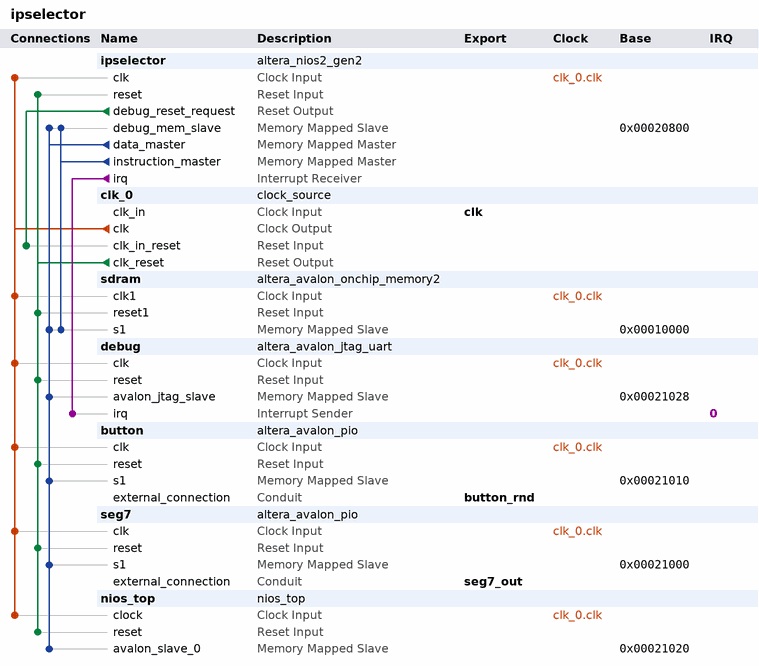
[diagram p0: system contents]
# Platform Designer (Qsys) system ipselector, MAX 10 10M50DAF484C7G
# Parameters at their usual value, and those the tool derives, are not listed.
package require -exact qsys 22.1
create_system ipselector
set_project_property DEVICE_FAMILY {MAX 10}
set_project_property DEVICE 10M50DAF484C7G

add_instance ipselector altera_nios2_gen2 22.1
set_instance_parameter_value ipselector dcache_size 2048
set_instance_parameter_value ipselector exceptionSlave sdram.s1
set_instance_parameter_value ipselector icache_size 4096
set_instance_parameter_value ipselector impl Tiny
set_instance_parameter_value ipselector resetSlave sdram.s1

add_instance clk_0 clock_source 22.1
set_instance_parameter_value clk_0 clockFrequency 50000000

add_instance sdram altera_avalon_onchip_memory2 22.1
set_instance_parameter_value sdram dataWidth 16
set_instance_parameter_value sdram dualPort false
set_instance_parameter_value sdram initMemContent true
set_instance_parameter_value sdram initializationFileName onchip_mem.hex
set_instance_parameter_value sdram memorySize 40960

add_instance debug altera_avalon_jtag_uart 22.1
set_instance_parameter_value debug simInteractiveOptions NO_INTERACTIVE_WINDOWS

add_instance button altera_avalon_pio 22.1
set_instance_parameter_value button direction Input
set_instance_parameter_value button width 1

add_instance seg7 altera_avalon_pio 22.1
set_instance_parameter_value seg7 direction Output
set_instance_parameter_value seg7 width 8

add_instance nios_top nios_top 1.0

# connections
add_connection clk_0.clk button.clk clock
add_connection clk_0.clk debug.clk clock
add_connection clk_0.clk ipselector.clk clock
add_connection clk_0.clk nios_top.clock clock
add_connection clk_0.clk sdram.clk1 clock
add_connection clk_0.clk seg7.clk clock
add_connection clk_0.clk_reset button.reset reset
add_connection clk_0.clk_reset debug.reset reset
add_connection clk_0.clk_reset ipselector.reset reset
add_connection clk_0.clk_reset nios_top.reset reset
add_connection clk_0.clk_reset sdram.reset1 reset
add_connection clk_0.clk_reset seg7.reset reset
add_connection ipselector.debug_reset_request clk_0.clk_in_reset reset
add_connection ipselector.data_master button.s1 avalon
set_connection_parameter_value ipselector.data_master/button.s1 baseAddress 0x00021010
add_connection ipselector.data_master debug.avalon_jtag_slave avalon
set_connection_parameter_value ipselector.data_master/debug.avalon_jtag_slave baseAddress 0x00021028
add_connection ipselector.data_master ipselector.debug_mem_slave avalon
set_connection_parameter_value ipselector.data_master/ipselector.debug_mem_slave baseAddress 0x00020800
add_connection ipselector.data_master nios_top.avalon_slave_0 avalon
set_connection_parameter_value ipselector.data_master/nios_top.avalon_slave_0 baseAddress 0x00021020
add_connection ipselector.data_master sdram.s1 avalon
set_connection_parameter_value ipselector.data_master/sdram.s1 baseAddress 0x00010000
add_connection ipselector.data_master seg7.s1 avalon
set_connection_parameter_value ipselector.data_master/seg7.s1 baseAddress 0x00021000
add_connection ipselector.instruction_master ipselector.debug_mem_slave avalon
set_connection_parameter_value ipselector.instruction_master/ipselector.debug_mem_slave baseAddress 0x00020800
add_connection ipselector.instruction_master sdram.s1 avalon
set_connection_parameter_value ipselector.instruction_master/sdram.s1 baseAddress 0x00010000
add_connection ipselector.irq debug.irq interrupt
set_connection_parameter_value ipselector.irq/debug.irq irqNumber 0

# exported interfaces
add_interface button_rnd conduit end
set_interface_property button_rnd EXPORT_OF button.external_connection
add_interface clk clock sink
set_interface_property clk EXPORT_OF clk_0.clk_in
add_interface seg7_out conduit end
set_interface_property seg7_out EXPORT_OF seg7.external_connection

set_interconnect_requirement {$system} qsys_mm.clockCrossingAdapter HANDSHAKE
set_interconnect_requirement {$system} qsys_mm.enableEccProtection FALSE
set_interconnect_requirement {$system} qsys_mm.insertDefaultSlave FALSE
set_interconnect_requirement {$system} qsys_mm.maxAdditionalLatency 1

save_system ipselector.qsys
